# Altium schematic sheet caiji.SchDoc: 采集板的电源模块
size A4
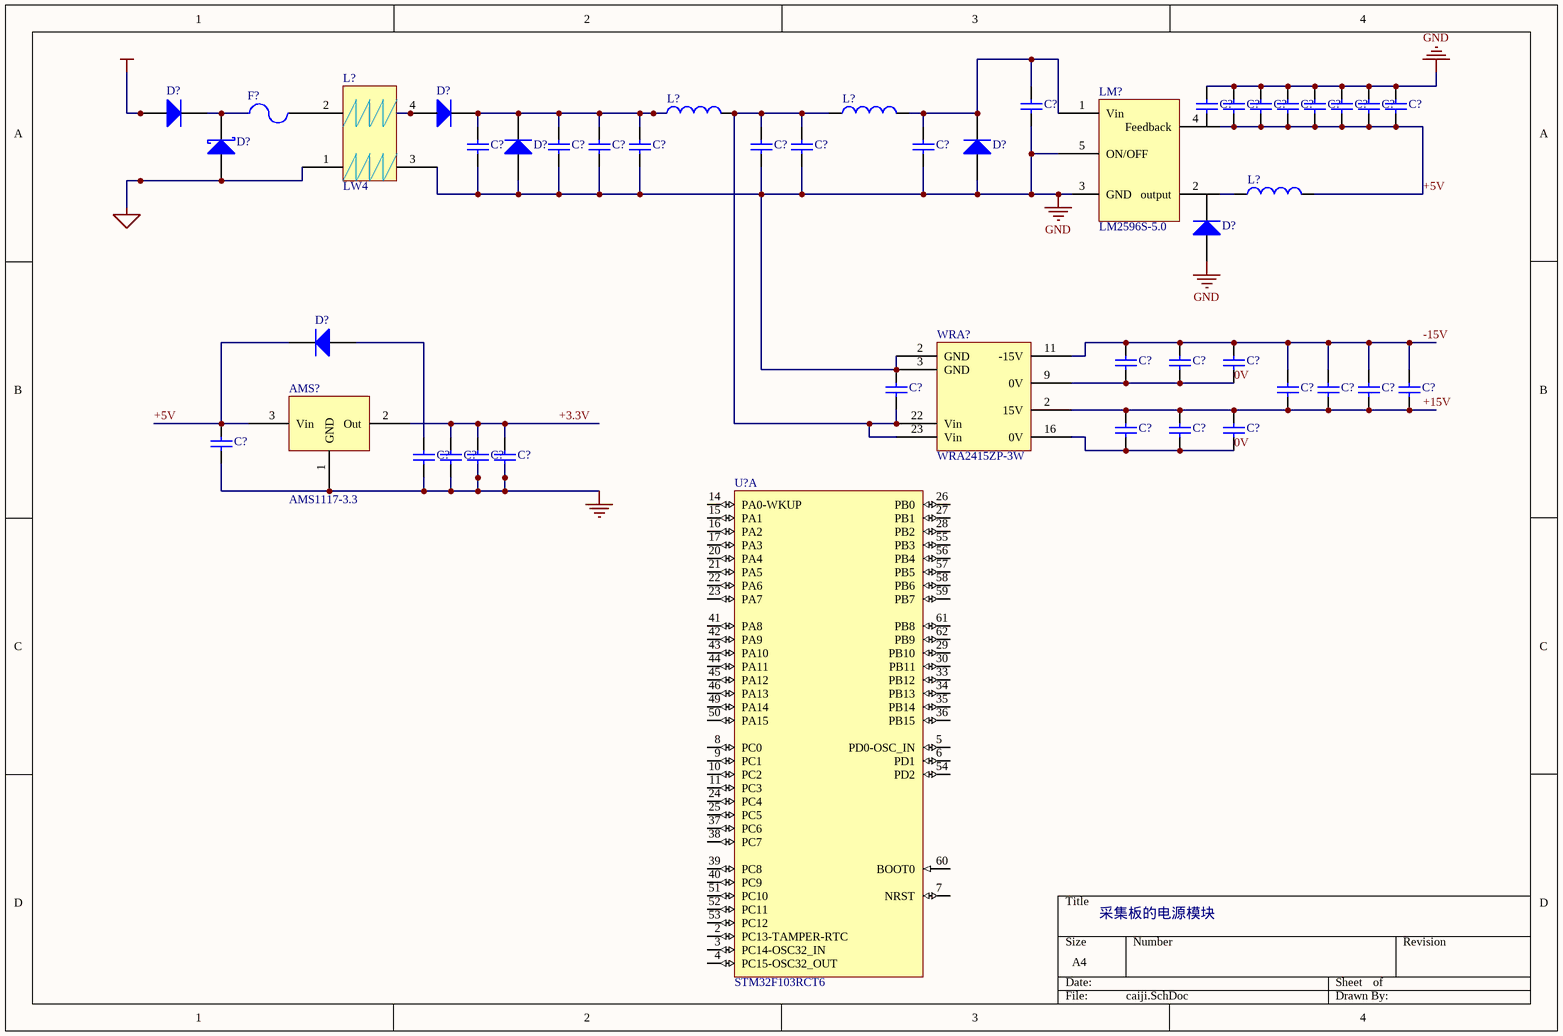
[diagram p0: caiji.SchDoc]

## Parts
(Parts that share a designator on the sheet are numbered #1, #2 ... from top to bottom, then left to right.)
AMS?  AMS1117-3.3
C?#1  Cap  [RAD-0.3]  (value not drawn)
C?#2  Cap  [RAD-0.3]  (value not drawn)
C?#3  Cap  [RAD-0.3]  (value not drawn)
C?#4  Cap  [RAD-0.3]  (value not drawn)
C?#5  Cap  [RAD-0.3]  (value not drawn)
C?#6  Cap  [RAD-0.3]  (value not drawn)
C?#7  Cap  [RAD-0.3]  (value not drawn)
C?#8  Cap  [RAD-0.3]  (value not drawn)
C?#9  Cap  [RAD-0.3]  (value not drawn)
C?#10  Cap  [RAD-0.3]  (value not drawn)
C?#11  Cap  [RAD-0.3]  (value not drawn)
C?#12  Cap  [RAD-0.3]  (value not drawn)
C?#13  Cap  [RAD-0.3]  (value not drawn)
C?#14  Cap  [RAD-0.3]  (value not drawn)
C?#15  Cap  [RAD-0.3]  (value not drawn)
C?#16  Cap  [RAD-0.3]  (value not drawn)
C?#17  Cap  [RAD-0.3]  (value not drawn)
C?#18  Cap  [RAD-0.3]  (value not drawn)
C?#19  Cap  [RAD-0.3]  (value not drawn)
C?#20  Cap  [RAD-0.3]  (value not drawn)
C?#21  Cap  [RAD-0.3]  (value not drawn)
C?#22  Cap  [RAD-0.3]  (value not drawn)
C?#23  Cap  [RAD-0.3]  (value not drawn)
C?#24  Cap  [RAD-0.3]  (value not drawn)
C?#25  Cap  [RAD-0.3]  (value not drawn)
C?#26  Cap  [RAD-0.3]  (value not drawn)
C?#27  Cap  [RAD-0.3]  (value not drawn)
C?#28  Cap  [RAD-0.3]  (value not drawn)
C?#29  Cap  [RAD-0.3]  (value not drawn)
C?#30  Cap  [RAD-0.3]  (value not drawn)
C?#31  Cap  [RAD-0.3]  (value not drawn)
C?#32  Cap  [RAD-0.3]  (value not drawn)
D?#1  Diode 1N4007  [DO-41]  (value not drawn)
D?#2  Diode 1N4007  [DO-41]  (value not drawn)
D?#3  D Schottky  [SMB]  (value not drawn)
D?#4  Diode  [SMC]  (value not drawn)
D?#5  Diode  [SMC]  (value not drawn)
D?#6  Diode  [SMC]  (value not drawn)
D?#7  Diode 1N4007  [DO-41]  (value not drawn)
F?  Fuse 2  [PIN-W2/E2.8]  (value not drawn)
L?#1  Inductor  [0402-A]  (value not drawn)
L?#2  Inductor  [0402-A]  (value not drawn)
L?#3  LW4  [30]
L?#4  Inductor  [0402-A]  (value not drawn)
LM?  LM2596S-5.0
U?  STM32F103RCT6  [LQFP64_N]  (part A of 2)
WRA?  WRA2415ZP-3W

## Nets
AGND: D?#3.1(A) L?#3.1
GND: AMS?.1(GND) C?#1.1 C?#2.1 C?#3.1 C?#4.1 C?#5.1 C?#6.1 C?#7.1 C?#8.1 C?#9.1 C?#10.1 C?#11.1 C?#12.1 C?#13.1 C?#14.1 C?#15.1 C?#16.1 C?#20.2 C?#28.1 C?#29.1 C?#30.1 C?#31.1 C?#32.1 D?#4.1(A) D?#5.1(A) D?#6.1(A) L?#3.3 LM?.3(GND) LM?.5(ON/OFF) WRA?.2(GND) WRA?.3(GND)
VCC: D?#1.1(A)
0V: C?#17.1 C?#18.1 C?#19.1 C?#25.1 C?#26.1 C?#27.1 WRA?.9(0V) WRA?.16(0V)
+3.3V: AMS?.2(Out) C?#30.2 C?#31.2 C?#32.2
+5V: AMS?.3(Vin) C?#2.2 C?#3.2 C?#4.2 C?#5.2 C?#6.2 C?#7.2 C?#8.2 C?#28.2 D?#7.2(K) L?#4.2 LM?.4(Feedback)
+15V: C?#21.1 C?#22.1 C?#23.1 C?#24.1 C?#25.2 C?#26.2 C?#27.2 WRA?.2(15V)
-15V: C?#17.2 C?#18.2 C?#19.2 C?#21.2 C?#22.2 C?#23.2 C?#24.2 WRA?.11(-15V)
NetC?#9_2: C?#9.2 C?#16.2 D?#5.2(K) L?#2.2 LM?.1(Vin)
NetC?#10_2: C?#10.2 C?#11.2 C?#12.2 C?#13.2 D?#2.2(K) D?#4.2(K) L?#1.1
NetC?#14_2: C?#14.2 C?#15.2 C?#20.1 L?#1.2 L?#2.1 WRA?.22(Vin) WRA?.23(Vin)
NetC?#29_2: C?#29.2 D?#7.1(A)
NetD?#1_2: D?#1.2(K) D?#3.2(K) F?.1
NetD?#2_1: D?#2.1(A) L?#3.4
NetF?_2: F?.2 L?#3.2
NetL?#4_1: L?#4.1 LM?.2(output)

Not connected (* = marked no-connect by the designer): C?#1 2; D?#6 2(K); U? 2(PC13-TAMPER-RTC) 3(PC14-OSC32_IN) 4(PC15-OSC32_OUT) 5(PD0-OSC_IN) 6(PD1) 7(NRST) 8(PC0) 9(PC1) 10(PC2) 11(PC3) 14(PA0-WKUP) 15(PA1) 16(PA2) 17(PA3) 20(PA4) 21(PA5) 22(PA6) 23(PA7) 24(PC4) 25(PC5) 26(PB0) 27(PB1) 28(PB2) 29(PB10) 30(PB11) 33(PB12) 34(PB13) 35(PB14) 36(PB15) 37(PC6) 38(PC7) 39(PC8) 40(PC9) 41(PA8) 42(PA9) 43(PA10) 44(PA11) 45(PA12) 46(PA13) 49(PA14) 50(PA15) 51(PC10) 52(PC11) 53(PC12) 54(PD2) 55(PB3) 56(PB4) 57(PB5) 58(PB6) 59(PB7) 60(BOOT0) 61(PB8) 62(PB9)

## Library data of the parts
AMS? = Component_1
C?#1-C?#32 = Cap: Capacitor; Value: 100pF; Published: 8-Jun-2000; LatestRevisionDate: 17-Jul-2002; LatestRevisionNote: Re-released for DXP Platform.; PackageReference: RAD-0.3; Publisher: Altium Limited
D?#1 D?#2 D?#7 = Diode 1N4007: 1 Amp General Purpose Rectifier; Published: 8-Jun-2000; LatestRevisionDate: 17-Jul-2002; LatestRevisionNote: Re-released for DXP Platform.; DatasheetDocument: 1998; PackageDocument: Aug-1999; PackageReference: DO-41; Publisher: Altium Limited; Code_JEDEC: DO-204-AL; ComponentLink1Description: Manufacturer Link; ComponentLink1URL: http://www.fairchildsemi.com/; ComponentLink2Description: Datasheet; ComponentLink2URL: http://www.fairchildsemi.com/ds/1N%2F1N4001.pdf
D?#3 = D Schottky: Schottky Diode; Published: 8-Jun-2000; LatestRevisionDate: 17-Jul-2002; LatestRevisionNote: Re-released for DXP Platform.; PackageReference: SMB; Publisher: Altium Limited; Code_JEDEC: DO-214-AA
D?#4-D?#6 = Diode: Default Diode; Published: 8-Jun-2000; LatestRevisionDate: 17-Jul-2002; LatestRevisionNote: Re-released for DXP Platform.; PackageDocument: Sep-1996; PackageReference: SMC; Publisher: Altium Limited; Code_JEDEC: DO-214-AB
F? = Fuse 2: Fuse; Published: 8-Jun-2000; LatestRevisionDate: 17-Jul-2002; LatestRevisionNote: Re-released for DXP Platform.; PackageReference: PIN-W2/E2.8; Publisher: Altium Limited
L?#1 L?#2 L?#4 = Inductor: Code_IEC: 1005; Value: 10mH; Published: 8-Jun-2000; LatestRevisionDate: 17-Jul-2002; LatestRevisionNote: Re-released for DXP Platform.; PackageReference: 0402-A; Publisher: Altium Limited; Code_JEITA: 0402
U? = STM32F103RCT6: STM32 ARM-based 32-bit MCU Performance Line with 256 kB Flash, 48 kB Internal RAM, -40 to +85°C Temperature, 64-Pin LQFP, Tray; DatasheetVersion: rev8.0, Apr-2011; PackageVersion: rev13, Apr-2011; PackageReference: LQFP64; PackageDescription: 64-Pin Low-Profile Quad Flat Pack, 10 x 10 mm Body, 0.5 mm Pitch (LQFP64); ComponentLink1Description: Manufacturer URL; ComponentLink1URL: http://www.st.com/; ComponentLink2Description: STM32F103 Datasheet; ComponentLink2URL: http://www.st.com/internet/com/TECHNICAL_RESOURCES/TECHNICAL_LITERATURE/DATASHEET/CD00191185.pdf; ComponentLink3Description: STM32 Family Web Page; ComponentLink3URL: www.st.com/stm32